# Altium schematic sheet HMS.Tran.SchDoc
size A
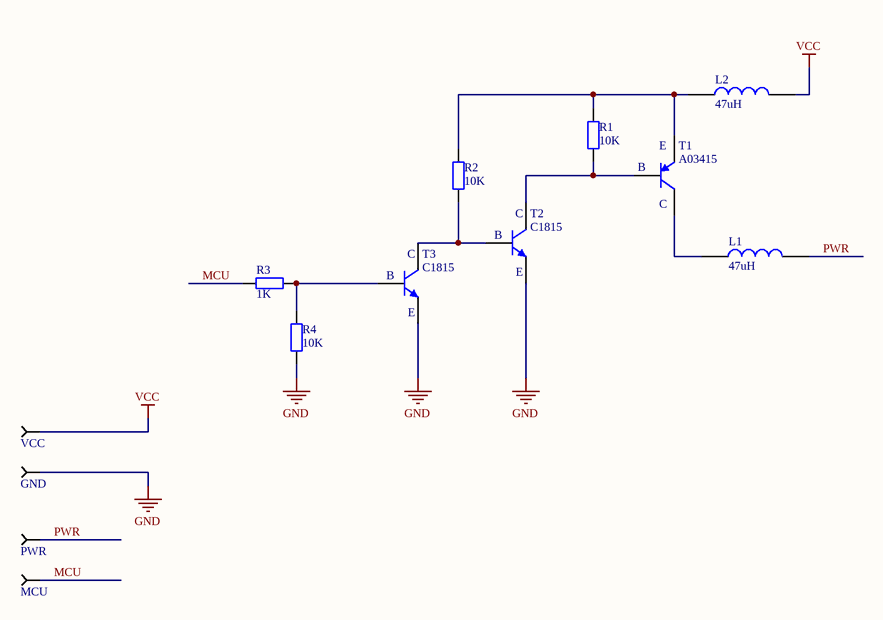
[diagram p0: HMS.Tran.SchDoc]

## Parts
(Parts that share a designator on the sheet are numbered #1, #2 ... from top to bottom, then left to right.)
*#1  VCC  [TestpoitSMD]
*#2  GND  [TestpoitSMD]
*#3  PWR  [TestpoitSMD]
*#4  MCU  [TestpoitSMD]
L1  47uH  [MPZ0805]
L2  47uH  [MPZ0805]
R1  10K  [RES_0402(1005)]
R2  10K  [RES_0402(1005)]
R3  1K  [RES_0402(1005)]
R4  10K  [RES_0402(1005)]
T1  A03415  [SOT23-3]
T2  C1815  [SOT23-3]
T3  C1815  [SOT23-3]

## Nets
GND: *#2.1 R4.1 T2.2 T3.2
VCC: *#1.1 L2.2
MCU: *#4.1 R3.1
PWR: *#3.1 L1.2
NetL1_1: L1.1 T1.3
NetL2_1: L2.1 R1.2 R2.2 T1.2
NetR1_1: R1.1 T1.1 T2.3
NetR2_1: R2.1 T2.1 T3.3
NetR3_2: R3.2 R4.2 T3.1

## Notes on the sheet
- (in symbol A03415) E; B; C
- (in symbol C18C5) C; B; E

## Library data of the parts
*#1-*#4 = Test Point SMD
L1 L2 = CBC2012T470M: INDUCTOR 47UH 20% 0805 SMD; MFR: Taiyo Yuden; Inductance: 47µH; Current Rating: 150mA; Current - Saturation: 120mA; Shielding: Unshielded; DC Resistance (DCR): 7.54 Ohm Max; Frequency - Self Resonant: 11MHz; Frequency - Test: 2.52MHz; Supplier 1: Digi-Key; MPN: CBC2012T470M; RoHS: RoHS Compliant; Category: Inductors, Coils, Chokes; Stock 1: 108934; Pricing 1: 1=0.2, 10=0.188, 50=0.1762, 100=0.1645, 500=0.12926, 1000=0.10575 (USD); Packaging: Cut Tape (CT); Type: -; Tolerance: ±20%; Material - Core: -; Q @ Freq: -; Operating Temperature: -40°C ~ 105°C; Package / Case: 0805 (2012 Metric); Size / Dimension: 0.079" L x 0.049" W x 0.049" H (2.00mm x 1.25mm x 1.25mm); Mounting Type: Surface Mount; ComponentLink1URL: http://www.yuden.co.jp/ut/product/category/inductor/CBC2012T470M.pdf; ComponentLink1Description: http://www.yuden.co.jp/ut/product/category/inductor/CBC2012T470M.pdf; Supplier Part Number 1: 587-1605-1-ND; Value: 47uH
R1-R4 = R0402: Resistor SMD 0402; Value: 0603; Published: 8-Jun-2000; LatestRevisionDate: 17-Jul-2002; LatestRevisionNote: Re-released for DXP Platform.; PackageReference: AXIAL-0.4; Publisher: Altium Limited
T1 = A03415: PNP General Purpose Amplifier; MFR: LinhKienChatLuong; MPN: A03415; Category: Transistor PNP
T2 T3 = C18C5: 50V 150mA NPN SMD Transistor SOT-23 Package; MPN: 2SC1815-HF; MFR: LinhKienChatLuong; Category: Transistor NPN; Value: 50V 150mA